# Altium schematic sheet 3-RF.SchDoc
size A3
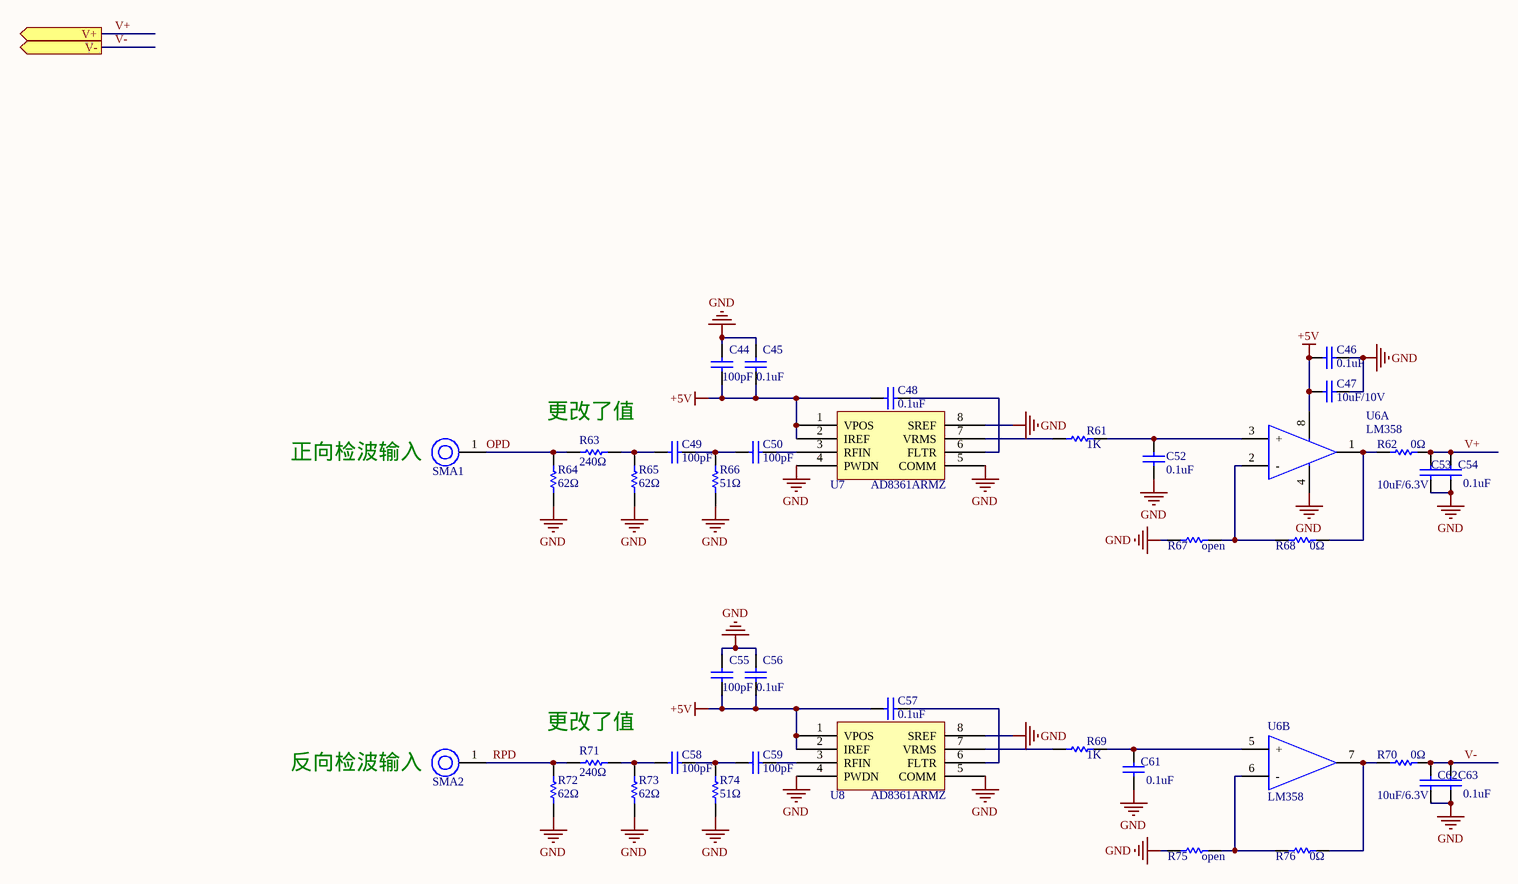
[diagram p0: 3-RF.SchDoc]

## Parts
C44  100pF  [C0603]
C45  0.1uF  [C0603]
C46  0.1uF  [C0603]
C47  10uF/10V  [C0805]
C48  0.1uF  [C0603]
C49  100pF  [C0805]
C50  100pF  [C0805]
C52  0.1uF  [C0603]
C53  10uF/6.3V  [C0603]
C54  0.1uF  [C0603]
C55  100pF  [C0603]
C56  0.1uF  [C0603]
C57  0.1uF  [C0603]
C58  100pF  [C0805]
C59  100pF  [C0805]
C61  0.1uF  [C0603]
C62  10uF/6.3V  [C0603]
C63  0.1uF  [C0603]
R61  1K  [R0603]
R62  0Ω  [R0603]
R63  240Ω  [R0805]
R64  62Ω  [R0805]
R65  62Ω  [R0805]
R66  51Ω  [R0805]
R67  open  [R0603]
R68  0Ω  [R0603]
R69  1K  [R0603]
R70  0Ω  [R0603]
R71  240Ω  [R0805]
R72  62Ω  [R0805]
R73  62Ω  [R0805]
R74  51Ω  [R0805]
R75  open  [R0603]
R76  0Ω  [R0603]
SMA1  SMA-50KFD-4  [SMA-50KFD-4]  (value not drawn)
SMA2  SMA-50KFD-4  [SMA-50KFD-4]  (value not drawn)
U6  LM358  [SOIC8_1R27_3R9x4R9]  (parts A,B of 2)
U7  AD8361ARMZ  [micro_SOIC8-0R65-3x3]
U8  AD8361ARMZ  [micro_SOIC8-0R65-3x3]

## Ports
V+ (out), V- (out)

## Nets
+5V: C44.1 C45.1 C46.1 C47.1 C48.2 C55.1 C56.1 C57.2 U6.8 U7.1(VPOS) U7.2(IREF) U8.1(VPOS) U8.2(IREF)
GND: C44.2 C45.2 C46.2 C47.2 C52.1 C53.1 C54.1 C55.2 C56.2 C61.1 C62.1 C63.1 R64.1 R65.1 R66.1 R67.1 R72.1 R73.1 R74.1 R75.1 U6.4 U7.4(PWDN) U7.5(COMM) U7.8(SREF) U8.4(PWDN) U8.5(COMM) U8.8(SREF)
OPD: R63.1 R64.2 SMA1.1(Sig)
RPD: R71.1 R72.2 SMA2.1(Sig)
V+: C53.2 C54.2 R62.2 ; port V+
V-: C62.2 C63.2 R70.2 ; port V-
NetC48_1: C48.1 U7.6(FLTR)
NetC49_1: C49.1 R63.2 R65.2
NetC49_2: C49.2 C50.1 R66.2
NetC50_2: C50.2 U7.3(RFIN)
NetC52_2: C52.2 R61.2 U6.3(+)
NetC57_1: C57.1 U8.6(FLTR)
NetC58_1: C58.1 R71.2 R73.2
NetC58_2: C58.2 C59.1 R74.2
NetC59_2: C59.2 U8.3(RFIN)
NetC61_2: C61.2 R69.2 U6.5(+)
NetR61_1: R61.1 U7.7(VRMS)
NetR62_1: R62.1 R68.2 U6.1
NetR67_2: R67.2 R68.1 U6.2(-)
NetR69_1: R69.1 U8.7(VRMS)
NetR70_1: R70.1 R76.2 U6.7
NetR75_2: R75.2 R76.1 U6.6(-)

## Notes on the sheet
- 更改了值
- 正向检波输入
- 反向检波输入

## Library data of the parts
C44 C55 = 220pF贴片电容: 贴片电容_100pF±10%,50V,0603
C45 C46 C48 C52 C54 C56 C57 C61 C63 = 0.1uF贴片电容: 贴片电容_GRM188R71H104KA01D_0.1uF±10%,50V,0603; code: 01010045
C47 = 10uF贴片电容: 贴片电容_GRM21BR61A106KE19L_10uF±10%,10V,0805; code: 01010036
C49 C50 C58 C59 = 100pF贴片电容: 贴片电容_GRM2165C1H101JA01D_100pF±5%,50V,0805; code: 01010043
C53 C62 = 10uF贴片电容: 贴片电容_GRM188R60J106ME47D_10uF±20%,6.3V,0603; code: 01010037
R61 R69 = 1K贴片电阻: 贴片电阻_1K±5%,0603; code: 01020082
R62 R68 R70 R76 = 0Ω贴片电阻: 贴片电阻_0Ω±5%,0603; code: 01020010
R63 R71 = 300Ω贴片电阻: 贴片电阻_300Ω±5%,0805; code: 01020037
R64 R65 R72 R73 = 62Ω贴片电阻: 贴片电阻_62Ω±5%,0805; code: 01020035
R66 R74 = 51Ω贴片电阻: 贴片电阻_51Ω±5%,0805; code: 01020023
R67 R75 = 0Ω贴片电阻
SMA1 SMA2 = SMA-50KFD-4: 射频同轴连接器_SMA-50KFD-4; code: 03100009
U6 = LM358: 运算放大器_LM358_SOIC8; Maker: MOTOROLA; code: 01060025
U7 U8 = AD8361ARMZ: 检波器_AD8361ARMZ_LF to 2.5 GHz,SOIC8; Maker: ADI; code: 01060004